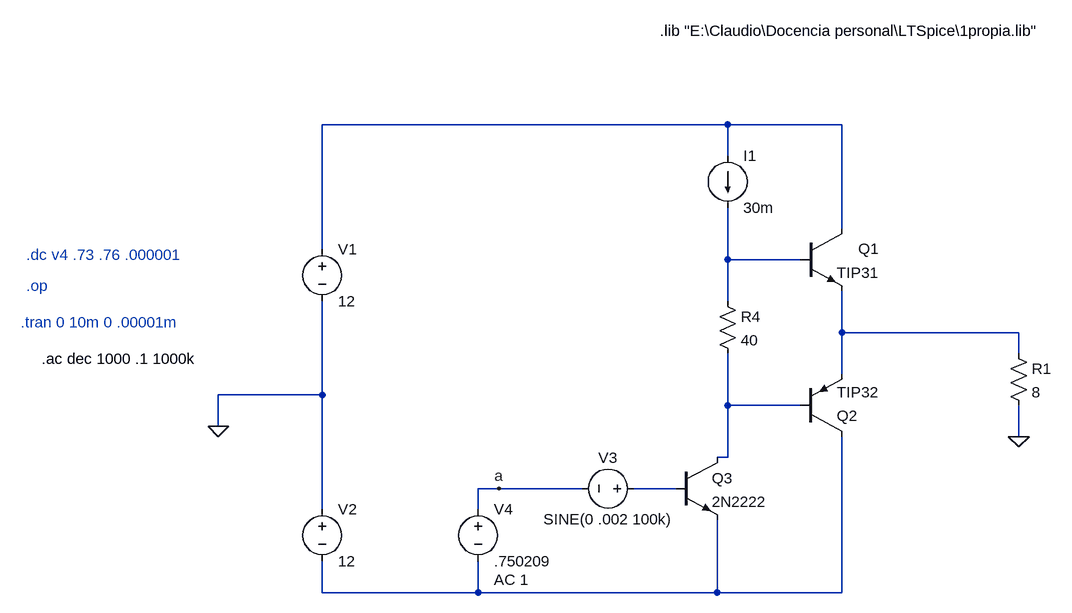
[diagram p0: schematic clase ab frecuencia 1.asc]
clase ab frecuencia 1.asc, the LTspice schematic file:
Version 4
SHEET 1 2388 1028
WIRE 112 160 -512 160
WIRE 288 160 112 160
WIRE 112 208 112 160
WIRE 288 320 288 160
WIRE -512 352 -512 160
WIRE 112 368 112 288
WIRE 224 368 112 368
WIRE 112 432 112 368
WIRE 288 480 288 416
WIRE 560 480 288 480
WIRE 560 512 560 480
WIRE 288 544 288 480
WIRE -512 576 -512 432
WIRE -512 576 -672 576
WIRE 112 592 112 512
WIRE 224 592 112 592
WIRE -672 624 -672 576
WIRE 560 640 560 592
WIRE 112 672 112 592
WIRE 112 672 96 672
WIRE -240 720 -272 720
WIRE -112 720 -240 720
WIRE 32 720 -32 720
WIRE -512 752 -512 576
WIRE -272 752 -272 720
WIRE -512 880 -512 832
WIRE -272 880 -272 832
WIRE -272 880 -512 880
WIRE 96 880 96 768
WIRE 96 880 -272 880
WIRE 288 880 288 640
WIRE 288 880 96 880
FLAG -672 624 0
FLAG 560 640 0
FLAG -240 720 a
DATAFLAG 560 480 ""
DATAFLAG 160 368 ""
DATAFLAG 208 592 ""
SYMBOL npn 224 320 R0
WINDOW 0 89 31 Left 2
SYMATTR InstName Q1
SYMATTR Value TIP31
SYMBOL pnp 224 640 M180
SYMATTR InstName Q2
SYMATTR Value TIP32
SYMBOL voltage -512 336 R0
WINDOW 123 0 0 Left 0
WINDOW 39 0 0 Left 0
SYMATTR InstName V1
SYMATTR Value 12
SYMBOL voltage -512 736 R0
WINDOW 123 0 0 Left 0
WINDOW 39 0 0 Left 0
SYMATTR InstName V2
SYMATTR Value 12
SYMBOL res 544 496 R0
SYMATTR InstName R1
SYMATTR Value 8
SYMBOL npn 32 672 R0
SYMATTR InstName Q3
SYMATTR Value 2N2222
SYMBOL voltage -16 720 R90
WINDOW 0 -32 56 VBottom 2
WINDOW 3 32 56 VTop 2
WINDOW 123 0 0 Left 0
WINDOW 39 0 0 Left 0
SYMATTR InstName V3
SYMATTR Value SINE(0 .002 100k)
SYMBOL voltage -272 736 R0
WINDOW 123 24 124 Left 2
WINDOW 39 0 0 Left 0
SYMATTR Value2 AC 1
SYMATTR InstName V4
SYMATTR Value .750209
SYMBOL res 96 416 R0
SYMATTR InstName R4
SYMATTR Value 40
SYMBOL current 112 208 R0
WINDOW 123 0 0 Left 0
WINDOW 39 0 0 Left 0
SYMATTR InstName I1
SYMATTR Value 30m
TEXT 8 16 Left 2 !.lib "E:\\Claudio\\Docencia personal\\LTSpice\\1propia.lib"
TEXT -976 464 Left 2 ;.tran 0 10m 0 .00001m
TEXT -968 408 Left 2 ;.op
TEXT -968 360 Left 2 ;.dc v4 .73 .76 .000001
TEXT -944 520 Left 2 !.ac dec 1000 .1 1000k

The netlist it stands for:
* clase ab frecuencia 1.asc
Q1 N001 N002 N003 0 TIP31
Q2 N006 N004 N003 0 TIP32
V1 N001 0 12
V2 0 N006 12
R1 N003 0 8
Q3 N004 N005 N006 0 2N2222
V3 N005 a SINE(0 .002 100k)
V4 a N006 .750209 AC 1
R4 N002 N004 40
I1 N001 N002 30m
.model NPN NPN
.model PNP PNP
.lib standard.bjt
.lib "E:\Claudio\Docencia personal\LTSpice\1propia.lib"
* .tran 0 10m 0 .00001m
* .op
* .dc v4 .73 .76 .000001
.ac dec 1000 .1 1000k
.backanno
.end